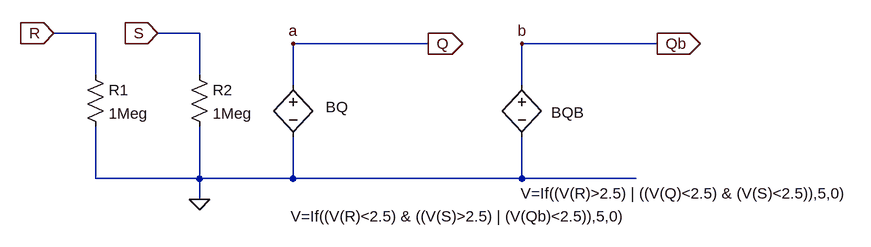
[diagram p0: schematic SR_latch_LLC.asc]
SR_latch_LLC.asc, the LTspice schematic file:
Version 4
SHEET 1 1112 680
WIRE -192 48 -256 48
WIRE -32 48 -96 48
WIRE 320 64 112 64
WIRE 672 64 464 64
WIRE -192 112 -192 48
WIRE -32 112 -32 48
WIRE 112 128 112 64
WIRE 464 128 464 64
WIRE -192 272 -192 192
WIRE -32 272 -32 192
WIRE -32 272 -192 272
WIRE 112 272 112 208
WIRE 112 272 -32 272
WIRE 464 272 464 208
WIRE 464 272 112 272
WIRE 640 272 464 272
WIRE -32 304 -32 272
FLAG -256 48 R
IOPIN -256 48 In
FLAG -96 48 S
IOPIN -96 48 In
FLAG 320 64 Q
IOPIN 320 64 Out
FLAG -32 304 0
FLAG 672 64 Qb
IOPIN 672 64 Out
FLAG 112 64 a
FLAG 464 64 b
SYMBOL bv 112 112 R0
WINDOW 0 50 50 Left 2
WINDOW 3 -4 218 Left 2
SYMATTR InstName BQ
SYMATTR Value V=If((V(R)<2.5) & ((V(S)>2.5) | (V(Qb)<2.5)),5,0)
SYMBOL res -208 96 R0
SYMATTR InstName R1
SYMATTR Value 1Meg
SYMBOL res -48 96 R0
SYMATTR InstName R2
SYMATTR Value 1Meg
SYMBOL bv 464 112 R0
WINDOW 0 45 58 Left 2
WINDOW 3 -2 183 Left 2
SYMATTR InstName BQB
SYMATTR Value V=If((V(R)>2.5) | ((V(Q)<2.5) & (V(S)<2.5)),5,0)

The netlist it stands for:
* SR_latch_LLC.asc
BQ a 0 V=If((V(R)<2.5) & ((V(S)>2.5) | (V(Qb)<2.5)),5,0)
R1 R 0 1Meg
R2 S 0 1Meg
BQB b 0 V=If((V(R)>2.5) | ((V(Q)<2.5) & (V(S)<2.5)),5,0)
.backanno
.end